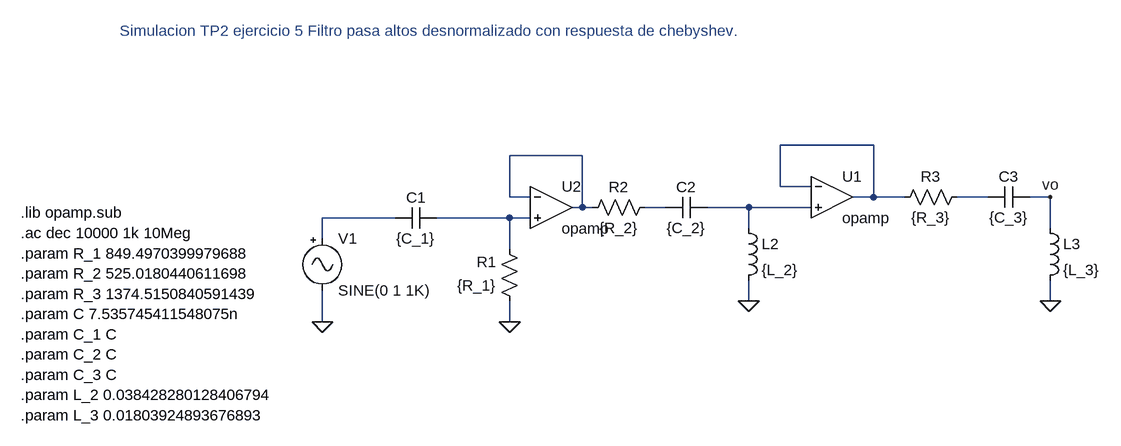
[diagram p0: schematic tp_2_5_hp.asc]
tp_2_5_hp.asc, the LTspice schematic file:
Version 4
SHEET 1 900 680
WIRE 544 192 400 192
WIRE 96 208 -16 208
WIRE 400 256 400 192
WIRE 448 256 400 256
WIRE -16 272 -16 208
WIRE 16 272 -16 272
WIRE 544 272 544 192
WIRE 544 272 512 272
WIRE 592 272 544 272
WIRE 720 272 672 272
WIRE 816 272 784 272
WIRE 96 288 96 208
WIRE 96 288 80 288
WIRE 112 288 96 288
WIRE 224 288 192 288
WIRE 352 288 288 288
WIRE 448 288 352 288
WIRE -192 304 -304 304
WIRE -16 304 -128 304
WIRE 16 304 -16 304
WIRE 352 320 352 288
WIRE 816 320 816 272
WIRE -304 336 -304 304
WIRE -16 352 -16 304
WIRE 352 432 352 400
WIRE 816 432 816 400
WIRE -304 464 -304 416
WIRE -16 464 -16 432
FLAG 352 432 0
FLAG 816 432 0
FLAG -304 464 0
FLAG 816 272 vo
FLAG -16 464 0
SYMBOL Opamps/opamp 480 208 R0
SYMATTR InstName U1
SYMBOL res 208 272 R90
WINDOW 0 0 56 VBottom 2
WINDOW 3 32 56 VTop 2
SYMATTR InstName R2
SYMATTR Value {R_2}
SYMBOL res 688 256 R90
WINDOW 0 0 56 VBottom 2
WINDOW 3 32 56 VTop 2
SYMATTR InstName R3
SYMATTR Value {R_3}
SYMBOL ind 336 304 R0
SYMATTR InstName L2
SYMATTR Value {L_2}
SYMBOL ind 800 304 R0
SYMATTR InstName L3
SYMATTR Value {L_3}
SYMBOL cap 784 288 M270
WINDOW 0 32 32 VTop 2
WINDOW 3 0 32 VBottom 2
SYMATTR InstName C3
SYMATTR Value {C_3}
SYMBOL cap 224 304 R270
WINDOW 0 32 32 VTop 2
WINDOW 3 0 32 VBottom 2
SYMATTR InstName C2
SYMATTR Value {C_2}
SYMBOL Misc/signal -304 320 R0
SYMATTR InstName V1
SYMATTR Value2 AC 1
SYMBOL Opamps/opamp 48 224 R0
SYMATTR InstName U2
SYMBOL cap -192 320 R270
WINDOW 0 32 32 VTop 2
WINDOW 3 0 32 VBottom 2
SYMATTR InstName C1
SYMATTR Value {C_1}
SYMBOL res 0 448 R180
WINDOW 0 36 76 Left 2
WINDOW 3 36 40 Left 2
SYMATTR InstName R1
SYMATTR Value {R_1}
TEXT -768 296 Left 2 !.lib opamp.sub\n.ac dec 10000 1k 10Meg\n.param R_1 849.4970399979688\n.param R_2 525.0180440611698\n.param R_3 1374.5150840591439\n.param C 7.535745411548075n\n.param C_1 C\n.param C_2 C\n.param C_3 C\n.param L_2 0.038428280128406794\n.param L_3 0.01803924893676893
TEXT -616 16 Left 2 ;Simulacion TP2 ejercicio 5 Filtro pasa altos desnormalizado con respuesta de chebyshev.

The netlist it stands for:
* tp_2_5_hp.asc
XU1 N001 N005 N001 opamp Aol=100K GBW=10Meg  ; pins invin noninvin out
R2 N004 N002 {R_2}
R3 N003 N001 {R_3}
L2 N005 0 {L_2}
L3 vo 0 {L_3}
C3 vo N003 {C_3}
C2 N004 N005 {C_2}
V1 N006 0 SINE(0 1 1K) AC 1
XU2 N002 N007 N002 opamp Aol=100K GBW=10Meg  ; pins invin noninvin out
C1 N006 N007 {C_1}
R1 0 N007 {R_1}
.lib opamp.sub
.ac dec 10000 1k 10Meg
.param R_1 849.4970399979688
.param R_2 525.0180440611698
.param R_3 1374.5150840591439
.param C 7.535745411548075n
.param C_1 C
.param C_2 C
.param C_3 C
.param L_2 0.038428280128406794
.param L_3 0.01803924893676893
* Simulacion TP2 ejercicio 5 Filtro pasa altos desnormalizado con respuesta de chebyshev.
.backanno
.end